# Altium schematic sheet EPS_I2C-Repeater.SchDoc: I2C Repeater
size A4; SheetNumber: 15; SheetTotal: 51
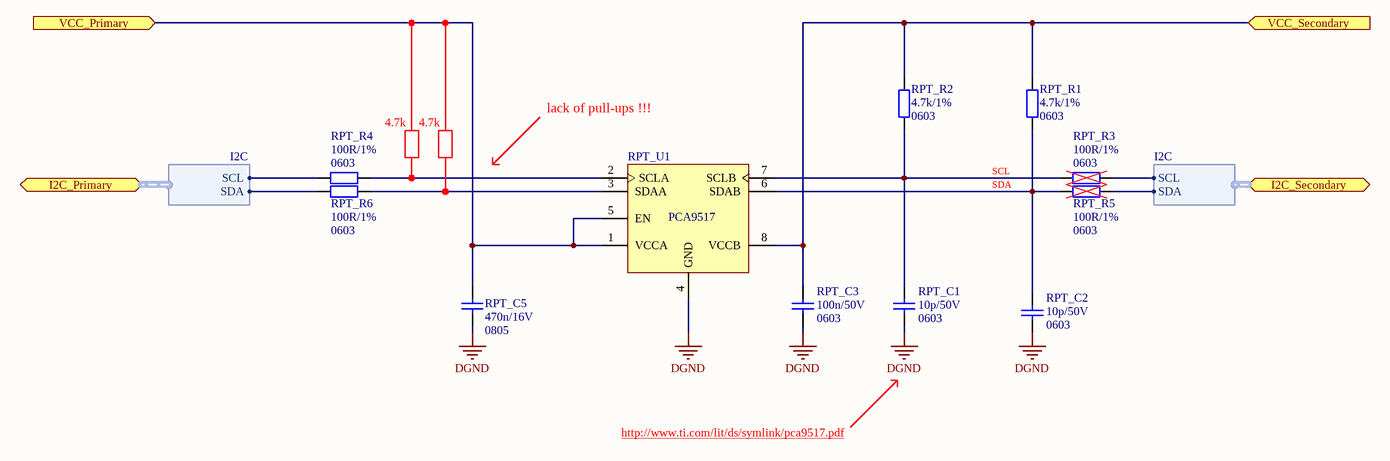
[diagram p0: EPS_I2C-Repeater.SchDoc]

## Parts
RPT_C1  Package: 0603  [SMD_Capacitor_0603]  (hidden comment: 10p/50V)
RPT_C2  Package: 0603  [SMD_Capacitor_0603]  (hidden comment: 10p/50V)
RPT_C3  Package: 0603  [SMD_Capacitor_0603]  (hidden comment: 100n/50V)
RPT_C5  value 470n/16V  Package: 0805  [SMD_Capacitor_0805]  (hidden comment: Cap)
RPT_R1  Package: 0603  [SMD_Resistor_0603]  (hidden comment: 4.7k/1%)
RPT_R2  Package: 0603  [SMD_Resistor_0603]  (hidden comment: 4.7k/1%)
RPT_R3  Package: 0603  [SMD_Resistor_0603]  (hidden comment: 100R/1%)
RPT_R4  Package: 0603  [SMD_Resistor_0603]  (hidden comment: 100R/1%)
RPT_R5  Package: 0603  [SMD_Resistor_0603]  (hidden comment: 100R/1%)
RPT_R6  Package: 0603  [SMD_Resistor_0603]  (hidden comment: 100R/1%)
RPT_U1  PCA9517  [TSSOP8_L]

## Ports
I2C_Primary (harness I2C), I2C_Secondary (harness I2C), VCC_Primary (in), VCC_Secondary (in)

## Harnesses
I2C: SDA, SCL

## Nets
DGND: RPT_C1.2 RPT_C2.2 RPT_C3.1 RPT_C5.2 RPT_U1.4(GND)
VCC_Primary: RPT_C5.1 RPT_U1.1(VCCA) RPT_U1.5(EN) ; port VCC_Primary
VCC_Secondary: RPT_C3.2 RPT_R1.1 RPT_R2.1 RPT_U1.8(VCCB) ; port VCC_Secondary
NetRPT_C1_1: RPT_C1.1 RPT_R2.2 RPT_R3.1 RPT_U1.7(SCLB)
NetRPT_C2_1: RPT_C2.1 RPT_R1.2 RPT_R5.1 RPT_U1.6(SDAB)
NetRPT_R3_2: RPT_R3.2 ; port I2C_Secondary.SCL
NetRPT_R4_1: RPT_R4.1 RPT_U1.2(SCLA)
NetRPT_R4_2: RPT_R4.2 ; port I2C_Primary.SCL
NetRPT_R5_2: RPT_R5.2 ; port I2C_Secondary.SDA
NetRPT_R6_1: RPT_R6.1 RPT_U1.3(SDAA)
NetRPT_R6_2: RPT_R6.2 ; port I2C_Primary.SDA

## Notes on the sheet
- 4.7k
- lack of pull-ups !!!
- SCL
- SDA
- http://www.ti.com/lit/ds/symlink/pca9517.pdf
- Title:
- Project:
- Author:
- Model:
- Document Number:
- Checked by:
- Rev:
- Date:
- Approved by:
- Sheet:
- of
- File name:

## Library data of the parts
RPT_C1 RPT_C2 = Cer_GCM1885C1H100JA16D: Ceramic Cap Murata Automotive 10p/50V C0G 0603; Manufacturer: Murata; ManufacturerPartNumber: GCM1885C1H100JA16D; Value: 10p/50V
RPT_C3 = Cer_C0603T104K5RALTU: Ceramic Cap Kemet COTS 100n/50V X7R 0603; Manufacturer: Kemet; ManufacturerPartNumber: C0603T104K5RALTU; Value: 100n/50V
RPT_R1 RPT_R2 = CRCW06034K70FKxxxx: 4.7k/1% Vishay CRCW 0603 Resistor. 100mW, 100ppm, 75V.; Manufacturer: Vishay; ManufactuerPartNumber: CRCW06034K70FKxxxx; Value: 4.7k/1%
RPT_R3-RPT_R6 = CRCW0603100RFKxxxx: 100R/1% Vishay CRCW 0603 Resistor. 100mW, 100ppm, 75V.; Manufacturer: Vishay; ManufacturerPartNumber: CRCW0603100RFKxxxx; Value: 100R/1%
RPT_U1 = PCA9517: Level-Translating I2C Bus Repeater; Manufacturer: Texas Instruments; ManufacturerPartNumber: PCA9517